# EAGLE design shifter (EAGLE 8.4.3)
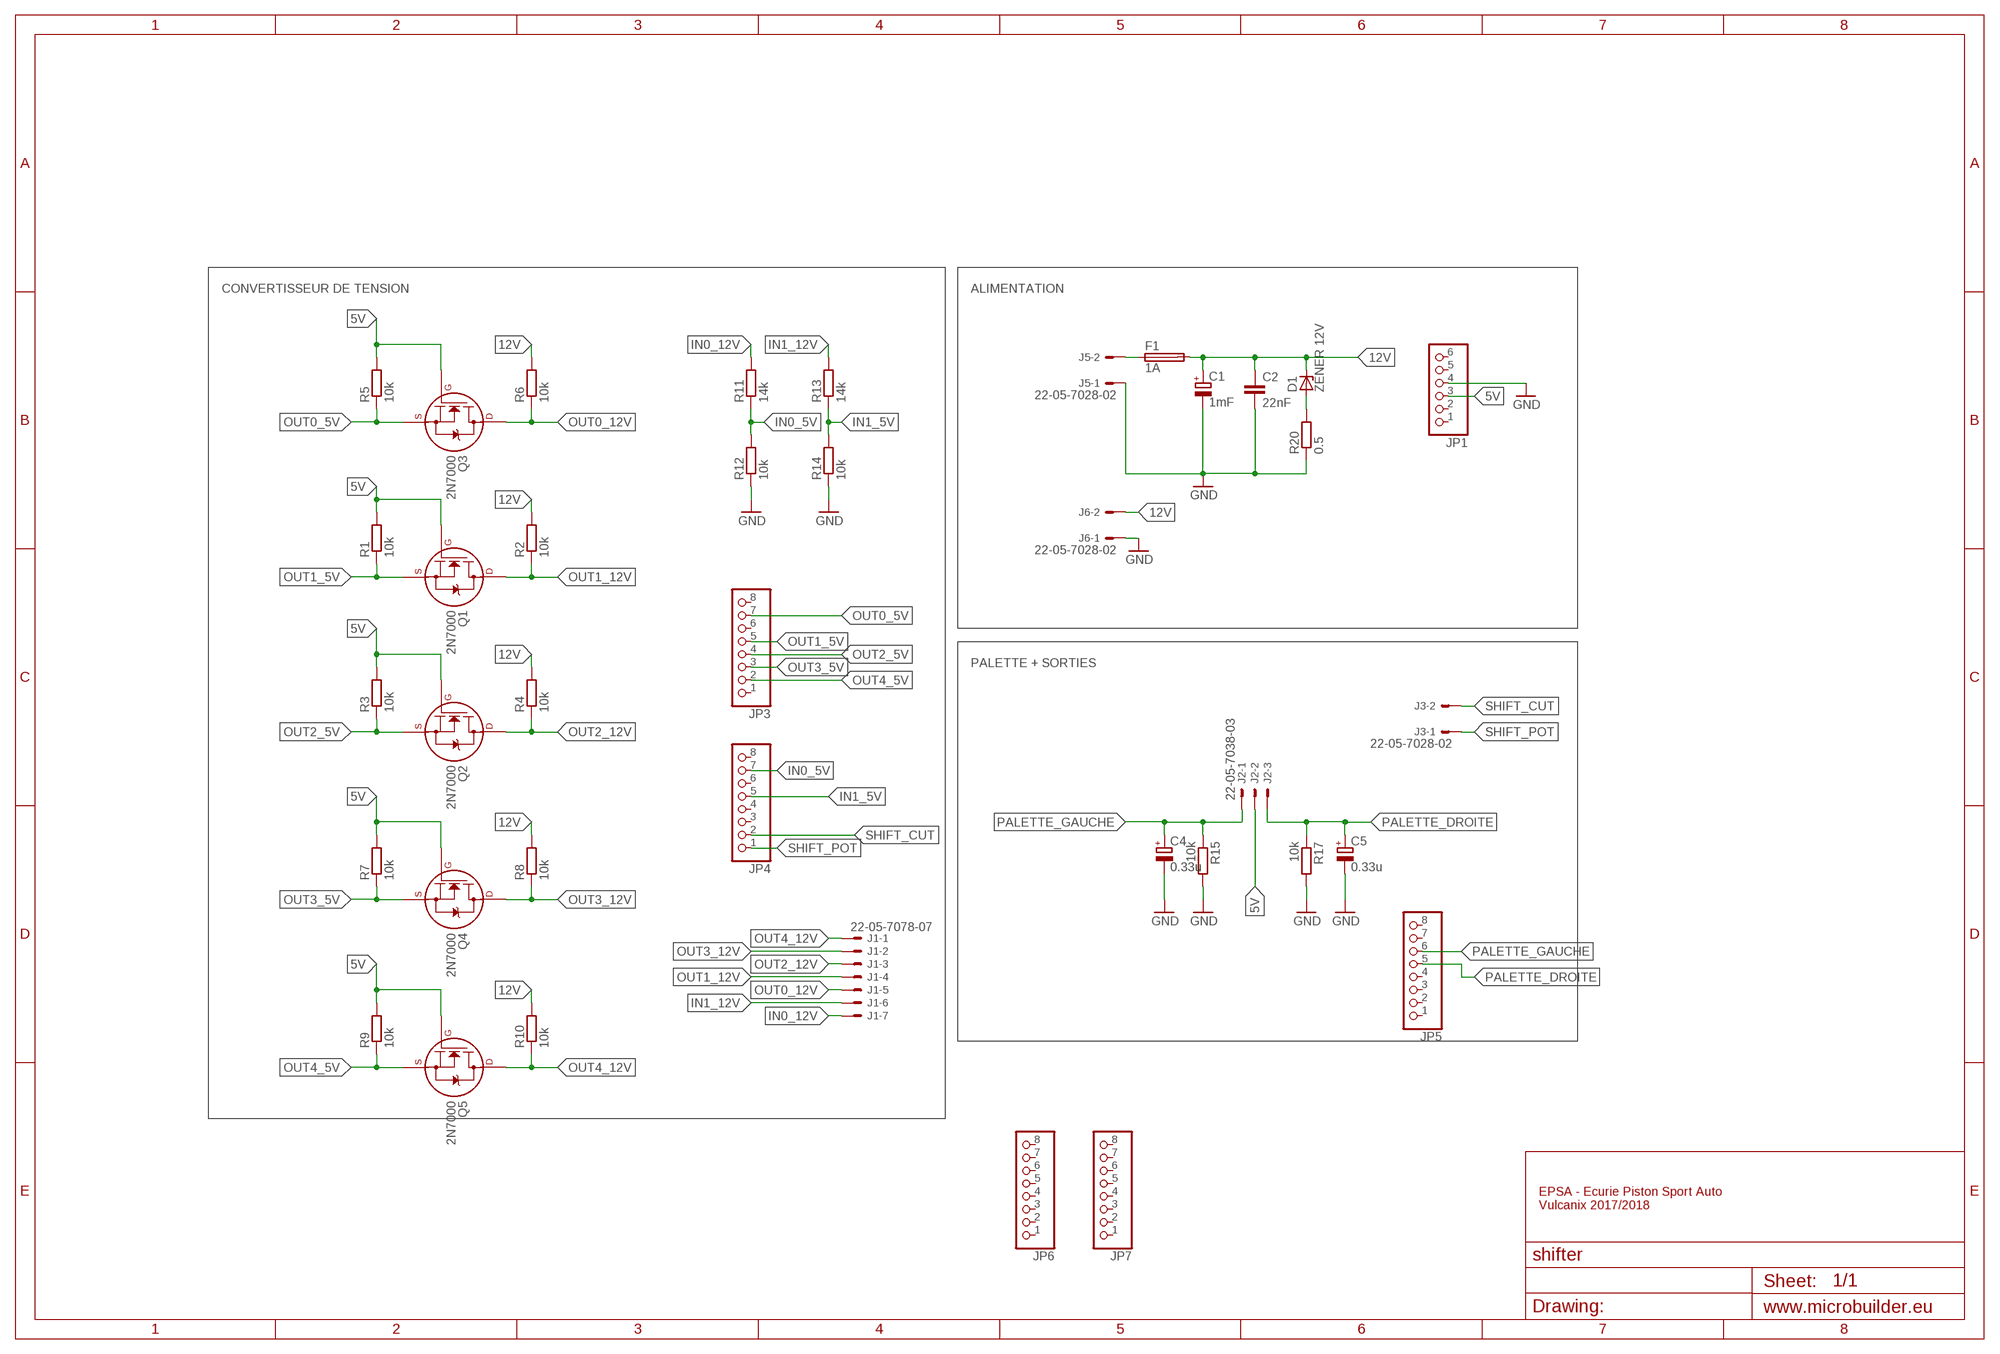
[diagram p0: schematic, sheet 1]

## Parts
C1  1mF  CPOL-EUE7.5-16  [E7,5-16]
C2  22nF  C-EU025-025X050  [C025-025X050]
C4  0.33u  CPOL-EUE2,5-6E  [E2,5-6E]
C5  0.33u  CPOL-EUE2,5-6E  [E2,5-6E]
D1  ZENER 12V  ZENER-DIODEDO41Z10  [DO41Z10]
F1  1A  SH25  [SH25]
J1  22-05-7078-07  [7395-07]
J2  22-05-7038-03  [7395-03]
J3  22-05-7028-02  [7395-02]
J5  22-05-7028-02  [7395-02]
J6  22-05-7028-02  [7395-02]
JP1  HEADER-1X6  [1X06_OVAL]
JP3  HEADER-1X8  [1X08_OVAL]
JP4  HEADER-1X8  [1X08_OVAL]
JP5  PINHD-1X8  [1X08]
JP6  PINHD-1X8  [1X08]
JP7  PINHD-1X8  [1X08]
Q1  2N7000  2N7000_TO92  [TO-92]
Q2  2N7000  2N7000_TO92  [TO-92]
Q3  2N7000  2N7000_TO92  [TO-92]
Q4  2N7000  2N7000_TO92  [TO-92]
Q5  2N7000  2N7000_TO92  [TO-92]
R1  10k  R-EU_0204/7  [0204/7]
R2  10k  R-EU_0204/7  [0204/7]
R3  10k  R-EU_0204/7  [0204/7]
R4  10k  R-EU_0204/7  [0204/7]
R5  10k  R-EU_0204/7  [0204/7]
R6  10k  R-EU_0204/7  [0204/7]
R7  10k  R-EU_0204/7  [0204/7]
R8  10k  R-EU_0204/7  [0204/7]
R9  10k  R-EU_0204/7  [0204/7]
R10  10k  R-EU_0204/7  [0204/7]
R11  14k  R-EU_0204/7  [0204/7]
R12  10k  R-EU_0204/7  [0204/7]
R13  14k  R-EU_0204/7  [0204/7]
R14  10k  R-EU_0204/7  [0204/7]
R15  10k  R-EU_0204/7  [0204/7]
R17  10k  R-EU_0204/7  [0204/7]
R20  0.5  R-EU_0309/12  [0309/12]

## Nets
5V: J2.2 JP1.3 Q1.2(G) Q2.2(G) Q3.2(G) Q4.2(G) Q5.2(G) R1.2 R3.2 R5.2 R7.2 R9.2
12V: C1.+ C2.1 D1.C F1.2 J6.2 R2.2 R4.2 R6.2 R8.2 R10.2
GND: C1.- C2.2 C4.- C5.- J5.1 J6.1 JP1.4 R12.1 R14.1 R15.2 R17.2 R20.1
IN0_5V: JP4.7 R11.1 R12.2
IN0_12V: J1.7 R11.2
IN1_5V: JP4.5 R13.1 R14.2
IN1_12V: J1.6 R13.2
N$1: F1.1 J5.2
N$4: D1.A R20.2
OUT0_5V: JP3.7 Q3.1(S) R5.1
OUT0_12V: J1.5 Q3.3(D) R6.1
OUT1_5V: JP3.5 Q1.1(S) R1.1
OUT1_12V: J1.4 Q1.3(D) R2.1
OUT2_5V: JP3.4 Q2.1(S) R3.1
OUT2_12V: J1.3 Q2.3(D) R4.1
OUT3_5V: JP3.3 Q4.1(S) R7.1
OUT3_12V: J1.2 Q4.3(D) R8.1
OUT4_5V: JP3.2 Q5.1(S) R9.1
OUT4_12V: J1.1 Q5.3(D) R10.1
PALETTE_DROITE: C5.+ J2.3 JP5.5 R17.1
PALETTE_GAUCHE: C4.+ J2.1 JP5.6 R15.1
SHIFT_CUT: J3.2 JP4.2
SHIFT_POT: J3.1 JP4.1
Unconnected: JP1.1 JP1.2 JP1.5 JP1.6 JP3.1 JP3.6 JP3.8 JP4.3 JP4.4 JP4.6 JP4.8 JP5.1 JP5.2 JP5.3 JP5.4 JP5.7 JP5.8 JP6.1 JP6.2 JP6.3 JP6.4 JP6.5 JP6.6 JP6.7 JP6.8 JP7.1 JP7.2 JP7.3 JP7.4 JP7.5 JP7.6 JP7.7 JP7.8

## Notes on the sheet
- CONVERTISSEUR DE TENSION | ALIMENTATION
- PALETTE + SORTIES
- EPSA - Ecurie Piston Sport Auto
  Vulcanix 2017/2018

## Library data of the parts
C1 C4 C5 = rcl:CPOL-EU: POLARIZED CAPACITOR, European symbol
C2 = rcl:C-EU: CAPACITOR, European symbol
D1 = diode:ZENER-DIODE: Z-Diode
F1 = fuse:SH25: FUSE HOLDER grid 25 mm, OGN0031 8211, Schurter (Buerklin); MF: SCHURTER; MPN: 0031.8211; OC_FARNELL: 1162741; OC_NEWARK: 96B9380
J1 = EP_molex_6410_7395:22-?-07: CONNECTOR wire to board 2.54 mm (.1 inch) pitch header
J2 = EP_molex_6410_7395:22-?-03: CONNECTOR wire to board 2.54 mm (.1 inch) pitch header
J3 J5 J6 = EP_molex_6410_7395:22-?-02: CONNECTOR wire to board 2.54 mm (.1 inch) pitch header
JP1 = microbuilder:HEADER-1X6: PIN HEADER
JP3 JP4 = microbuilder:HEADER-1X8: PIN HEADER
JP5-JP7 = pinhead:PINHD-1X8: PIN HEADER
Q1-Q5 = transistors:2N700*: 2N7000, 2N7002, NDS7002A N-channel enhancement mode MOSFET
R1-R15 R17 R20 = resistor:R-EU_: RESISTOR, European symbol

## Board
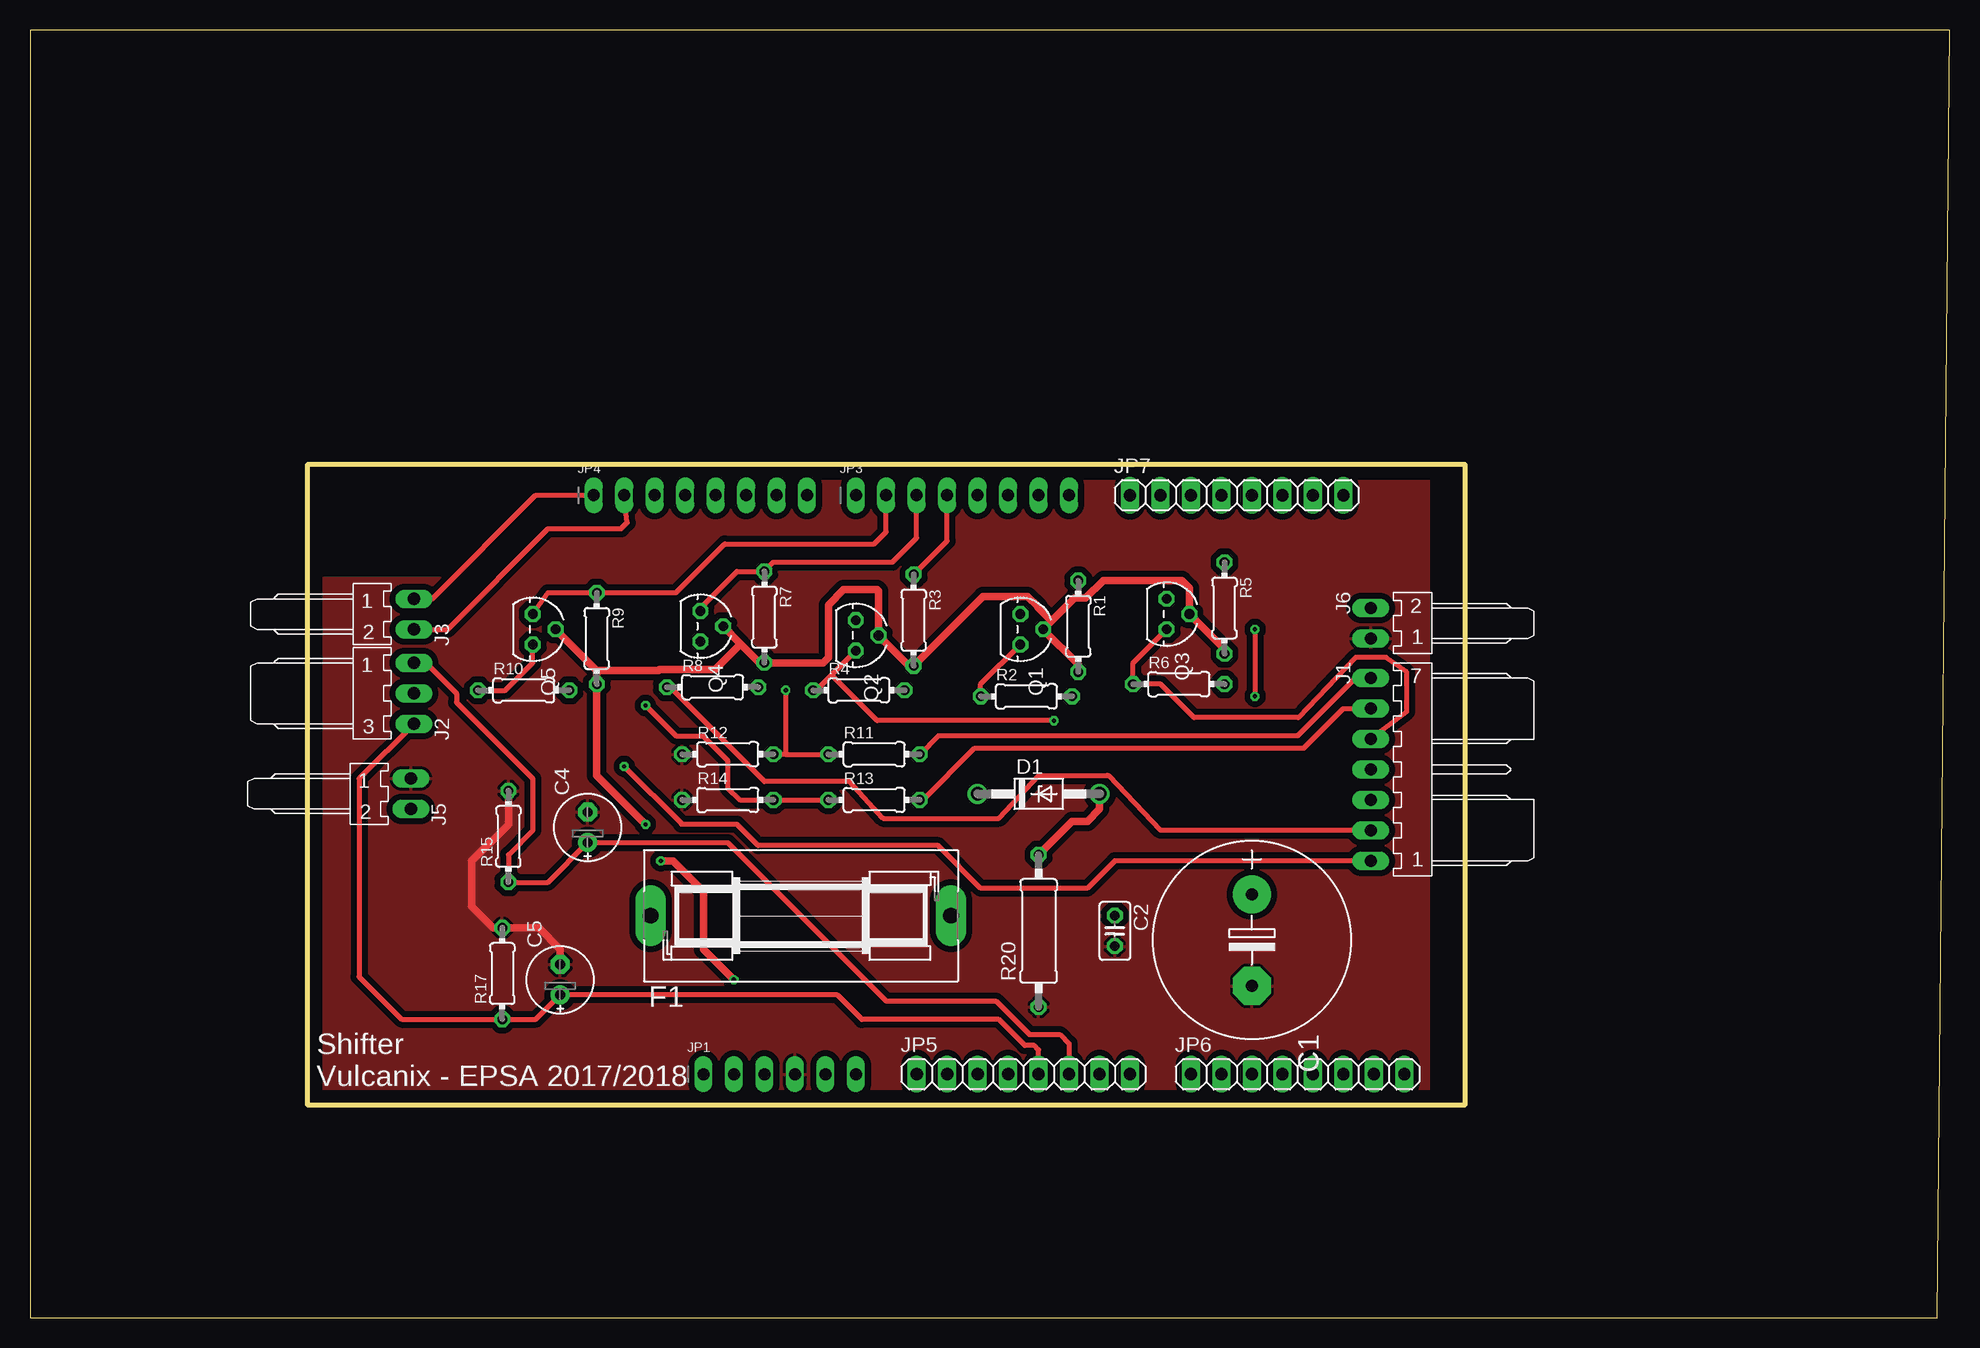
[diagram p1: board, top side]
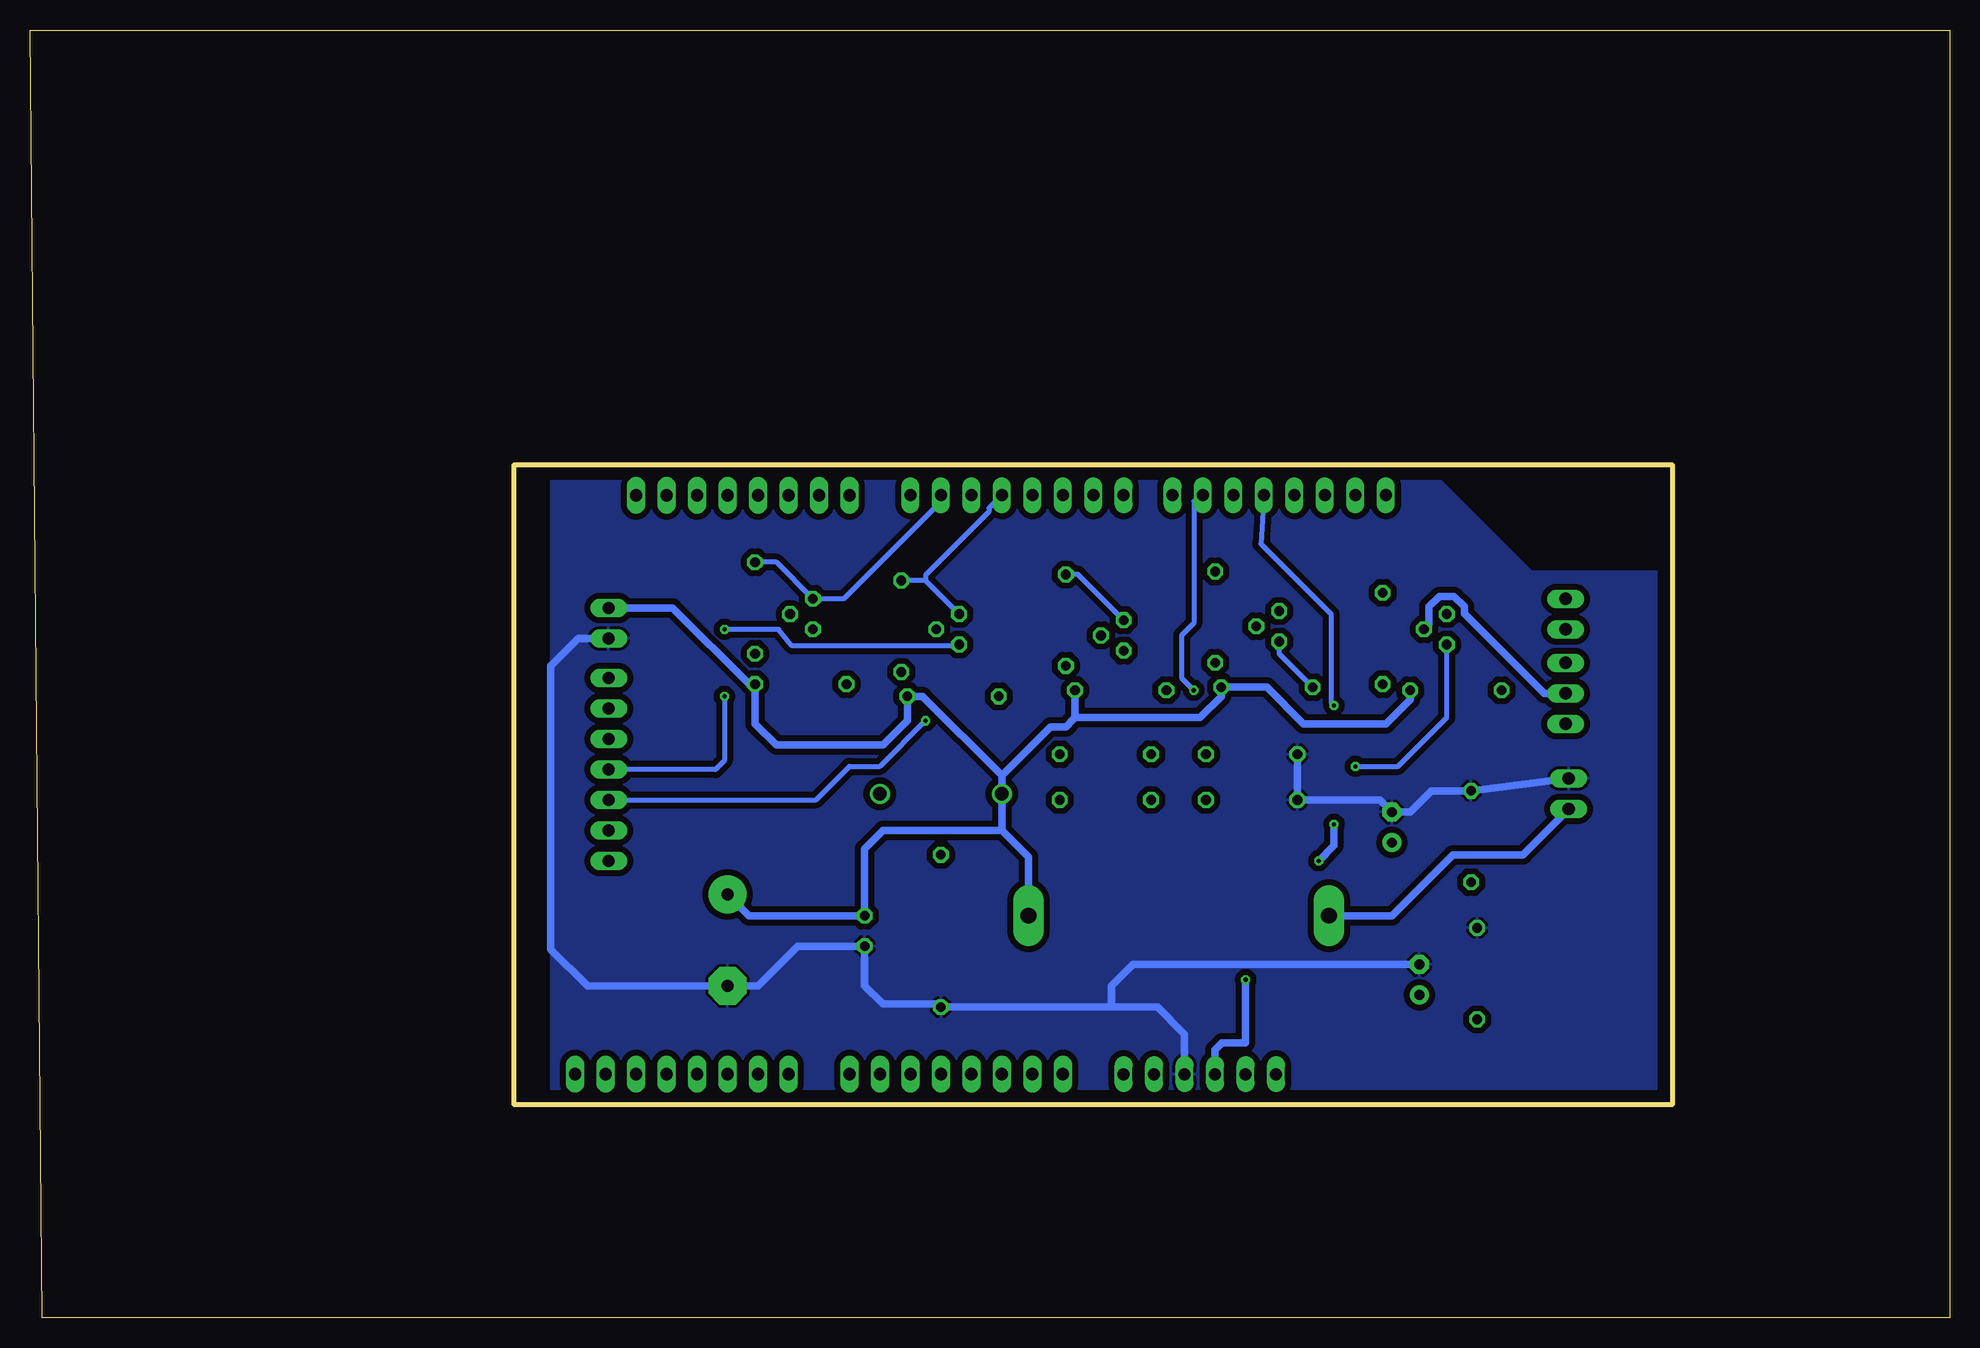
[diagram p2: board, bottom side, seen from below]

Size 160 x 107.37 mm. Coordinates in mm from the lower left corner, seen from the top.
Outline: 0,0 158.98,0 160,107.37 0,107.37 0,0
Outline: 23.11,71.12 23.11,17.78 119.63,17.78 119.63,71.12 23.11,71.12
Copper layers (1*16): Top 0.035mm / dielectric 1.5mm / Bottom 0.035mm
Design rules "default *": minimum track width 10mil, minimum drill 24mil, track to track 20mil, track to pad 20mil, pad to pad 20mil, via to via 20mil, smd to smd 8mil, copper to edge 40mil, drill to drill 8mil, minimum pad ring 10mil, minimum via ring 8mil, stop-mask expansion 4mil, vias tented up to drill 0mil, thermal gap 10mil

### Footprints (pad centres in the part's own frame; a part is rotated, then mirrored left to right if it is on the bottom)
E7,5-16 = drill 1.016 pad 3.15: + -3.81,0 | drill 1.016 pad 3.15 octagon: - 3.81,0
C025-025X050 = drill 0.813 octagon: 1 -1.27,0; 2 1.27,0
E2,5-6E = drill 0.813 pad 1.575: + -1.27,0 | drill 0.813 pad 1.575 octagon: - 1.27,0
DO41Z10 = drill 1.118: A 5.08,0; C -5.08,0
SH25 = drill 1.321 pad 2.54 long: 1 -12.522,0; 2 12.522,0
7395-07 = drill 1.016 long: 1 7.62,0; 2 5.08,0; 3 2.54,0; 4 0,0; 5 -2.54,0; 6 -5.08,0; 7 -7.62,0
7395-03 = drill 1.016 long: 1 2.54,0; 2 0,0; 3 -2.54,0
7395-02 = drill 1.016 long: 1 1.27,0; 2 -1.27,0
1X06_OVAL = drill 1 long: 1 -6.35,0; 2 -3.81,0; 3 -1.27,0; 4 1.27,0; 5 3.81,0; 6 6.35,0
1X08_OVAL = drill 1 long: 1 -8.89,0; 2 -6.35,0; 3 -3.81,0; 4 -1.27,0; 5 1.27,0; 6 3.81,0; 7 6.35,0; 8 8.89,0
1X08 = drill 1.016 long: 1 -8.89,0; 2 -6.35,0; 3 -3.81,0; 4 -1.27,0; 5 1.27,0; 6 3.81,0; 7 6.35,0; 8 8.89,0
TO-92 = drill 0.813 octagon: 1 -1.27,0; 2 0,1.905; 3 1.27,0
0204/7 = drill 0.813 octagon: 1 -3.81,0; 2 3.81,0
0309/12 = drill 0.813 octagon: 1 -6.35,0; 2 6.35,0

### Placement (x,y rotation side)
C1  101.85,31.5 270 top
C2  90.42,32.26 270 top
C4  46.48,40.89 90 top
C5  44.2,28.19 90 top
D1  84.07,43.69 0 top
F1  64.26,33.53 0 top
J1  111.76,45.72 270 top
J2  32,52.07 90 top
J3  32,58.67 90 top
J5  31.75,43.69 90 top
J6  111.76,57.91 270 top
JP1  62.48,20.32 0 top
JP3  77.72,68.58 0 top
JP4  55.88,68.58 0 top
JP5  82.8,20.32 0 top
JP6  105.66,20.32 0 top
JP7  100.58,68.58 0 top
Q1  82.55,57.4 270 top
Q2  68.83,56.9 270 top
Q3  94.74,58.67 270 top
Q4  55.88,57.66 270 top
Q5  41.91,57.4 270 top
R1  87.38,57.66 270 top
R2  83.06,51.82 0 top
R3  73.66,58.17 270 top
R4  69.09,52.32 0 top
R5  99.57,59.18 270 top
R6  95.76,52.83 0 top
R7  61.21,58.42 270 top
R8  56.9,52.58 0 top
R9  47.24,56.64 270 top
R10  41.15,52.32 0 top
R11  70.36,46.99 0 top
R12  58.17,46.99 0 top
R13  70.36,43.18 0 top
R14  58.17,43.18 0 top
R15  39.88,40.13 90 top
R17  39.37,28.7 90 top
R20  84.07,32.26 90 top

### Tracks (layer width: path | path; a pad name or v marks a point on that pad's centre or on a via)
5V  (via drill 0.35)
  Top 0.61: Q5.2 47.24,53.98 | 47.24,53.98 R9.2 47.24,45.21 v51.31,41.15 | 59.25,56.2 Q4.2 57.73,57.61 | 59.25,56.2 60.83,54.61 R7.2 66.09,54.61 66.55,55.06 66.55,59.44 67.82,60.71 70.61,60.71 70.74,60.58 Q2.2 | Q2.2 73.28,54.36 R3.2 79.45,60.15 83.16,60.15 84.02,59.28 84.02,59.23 85.15,58.1 | R1.2 87.38,54.48 Q1.2 85.15,58.1 | R5.2 99.57,55.75 Q3.2 96.65,60.83 96.01,61.47 89.46,61.47 87.99,59.99 87.05,59.99 85.15,58.1 | 70.69,56.84 Q2.2 | v58.67,28.19 56.13,30.73 56.13,35.56 53.59,38.1 v52.58,38.1 | 59.25,56.2 57.1,54.05 52.48,54.05 52.4,53.98 47.24,53.98
  Bottom 0.61: J2.2 33.78,52.07 40.44,58.73 40.44,59.28 41.3,60.15 42.52,60.15 43.38,59.28 43.38,57.84 Q5.2 | v58.67,28.19 58.67,22.93 60.64,22.93 61.21,22.35 JP1.3 | v52.58,38.1 51.31,39.37 v51.31,41.15
12V
  Bottom 0.61: F1.2 76.78,38.43 78.99,40.64 | 78.99,40.64 D1.C 78.99,45.21 | 78.99,40.64 88.9,40.64 90.42,39.12 C2.1 100.08,33.53 C1.+ | 78.99,45.21 74.93,49.28 73.66,49.28 73.02,49.91 | 73.02,49.91 72.9,50.04 | 72.9,50.04 R4.2 | 78.99,45.21 85.6,51.82 R2.2 86.87,49.78 88.9,47.75 97.79,47.75 99.57,49.53 R6.2 100.08,52.83 106.43,59.18 J6.2 | 72.9,50.04 62.48,50.04 60.71,51.82 R8.2 56.9,52.58 53.85,49.53 46.99,49.53 44.96,51.56 R10.2 | 72.9,50.04 73.02,49.91
GND
  Top 0.61: C5.- 44.2,30.73 42.42,32.51 R17.2 38.61,32.51 36.83,34.29 36.83,38.1 39.88,41.15 R15.2
  Bottom 0.61: R12.1 R14.1 47.5,43.18 C4.- 44.96,42.16 43.18,43.94 R15.2 J5.1 | JP1.4 63.75,23.62 66.04,25.91 69.85,25.91 | 69.85,25.91 R20.1 84.33,26.16 88.9,26.16 90.42,27.69 C2.2 96.01,30.99 99.31,27.69 C1.- 113.54,27.69 116.59,30.73 116.59,54.36 114.3,56.64 J6.1 | C5.- 68.07,29.46 69.85,27.69 69.85,25.91
  pour Top: 24.13,61.72 34.29,61.72 42.93,70.36 116.59,70.36 116.59,18.8 24.13,18.8
  pour Bottom: 24.13,18.8 24.13,61.98 24.38,62.23 34.8,62.23 42.93,70.36 116.59,70.36 116.59,18.8
IN0_5V  (via drill 0.35)
  Top 0.406: 62.99,46.99 R11.1 | 62.99,46.99 R12.2 | v62.99,52.32 62.99,46.99
  Bottom 0.406: v62.99,52.32 64.01,53.34 64.01,56.9 62.99,57.91 62.99,68.07 JP4.7
IN0_12V
  Top 0.406: J1.7 110.49,53.34 105.66,48.51 75.69,48.51 R11.2
IN1_5V  (via drill 0.35)
  Top 0.406: R13.1 R14.2 59.18,43.18 58.17,44.2 58.17,46.46 56.11,48.51 53.85,48.51 v51.31,51.05
  Bottom 0.406: JP4.5 57.4,64.52 51.56,58.67 51.56,51.31 v51.31,51.05
IN1_12V
  Top 0.406: R13.2 74.42,43.18 78.74,47.5 106.17,47.5 109.47,50.8 J1.6
N$1
  Bottom 0.61: J5.2 35.56,38.61 41.4,38.61 46.48,33.53 F1.1
N$4
  Top 0.61: R20.2 86.87,41.4 88.14,41.4 89.15,42.42 D1.A
OUT0_5V
  Bottom 0.406: JP3.7 84.07,68.07 92.2,59.94 Q3.1 97.79,62.99 R5.1
OUT0_12V
  Top 0.406: Q3.3 91.95,54.61 R6.1 94.23,52.83 97.03,50.04 105.72,50.04 110.49,55.07 113.03,55.07 114.76,53.84 114.76,50.55 111.76,48.31 J1.5
OUT1_5V
  Bottom 0.406: 85.34,61.47 Q1.1 | 85.34,61.47 R1.1 | JP3.5 80.07,67.5 80.07,67.22 85.34,61.94 85.34,61.47
OUT1_12V  (via drill 0.35)
  Top 0.406: R2.1 79.25,52.83 Q1.3 | v102.11,57.4 v102.11,51.82
  Bottom 0.406: Q1.3 82.7,56.03 96.47,56.03 97.59,57.4 v102.11,57.4 | v102.11,51.82 102.11,46.48 102.87,45.72 J1.4
OUT2_5V
  Top 0.406: R3.1 76.45,64.77 JP3.4
  Bottom 0.406: Q2.1 72.64,61.98 R3.1
OUT2_12V  (via drill 0.35)
  Top 0.406: R4.1 65.53,52.32 66.8,53.59 | 66.8,53.59 Q2.3 | v85.34,49.78 70.61,49.78 66.8,53.59
  Bottom 0.406: J1.3 94.49,43.18 91.69,45.97 89.15,45.97 v85.34,49.78
OUT3_5V
  Top 0.406: Q4.1 55.88,59.18 58.93,62.23 R7.1 61.98,62.99 71.88,62.99 73.91,65.02 JP3.3
OUT3_12V
  Top 0.406: R8.1 53.09,52.83 61.21,44.7 68.33,44.7 71.12,41.66 80.77,41.66 84.1,45.24 89.8,45.24 89.82,45.21 89.92,45.21 94.23,40.64 J1.2
  Bottom 0.406: Q4.3 55.88,55.37 R8.1
OUT4_5V
  Top 0.406: Q5.1 43.18,60.45 R9.1 53.85,60.45 57.91,64.52 70.36,64.52 71.37,65.53 JP3.2
OUT4_12V  (via drill 0.35)
  Top 0.406: R10.1 39.62,52.32 41.91,54.61 Q5.3 | J1.1 90.42,38.1 88.14,35.81 79.25,35.81 75.69,39.37 60.71,39.37 58.93,41.15 54.3,41.15 54.3,41.2 v49.53,45.97
  Bottom 0.406: v49.53,45.97 45.97,45.97 41.91,50.04 Q5.3
PALETTE_DROITE
  Top 0.406: J2.3 27.43,44.96 27.43,28.45 30.99,24.89 R17.1 42.16,24.89 C5.+ 67.31,26.92 69.35,24.88 80.76,24.88 82.93,22.71 83.72,22.71 84.07,22.35 JP5.5
PALETTE_GAUCHE
  Top 0.406: J2.1 33.02,54.61 35.56,52.07 35.56,51.31 41.91,44.96 41.91,40.64 39.88,38.61 R15.1 43.18,36.32 C4.+ 58.17,39.62 71.37,26.42 80.52,26.42 83.31,23.62 85.85,23.62 86.61,22.86 JP5.6
SHIFT_CUT
  Top 0.406: J3.2 34.8,57.4 43.18,65.79 49.28,65.79 49.78,66.29 JP4.2
SHIFT_POT
  Top 0.406: J3.1 33.53,59.94 42.16,68.58 JP4.1

### Text on the board
tNames: Shifter / Vulcanix - EPSA 2017/2018